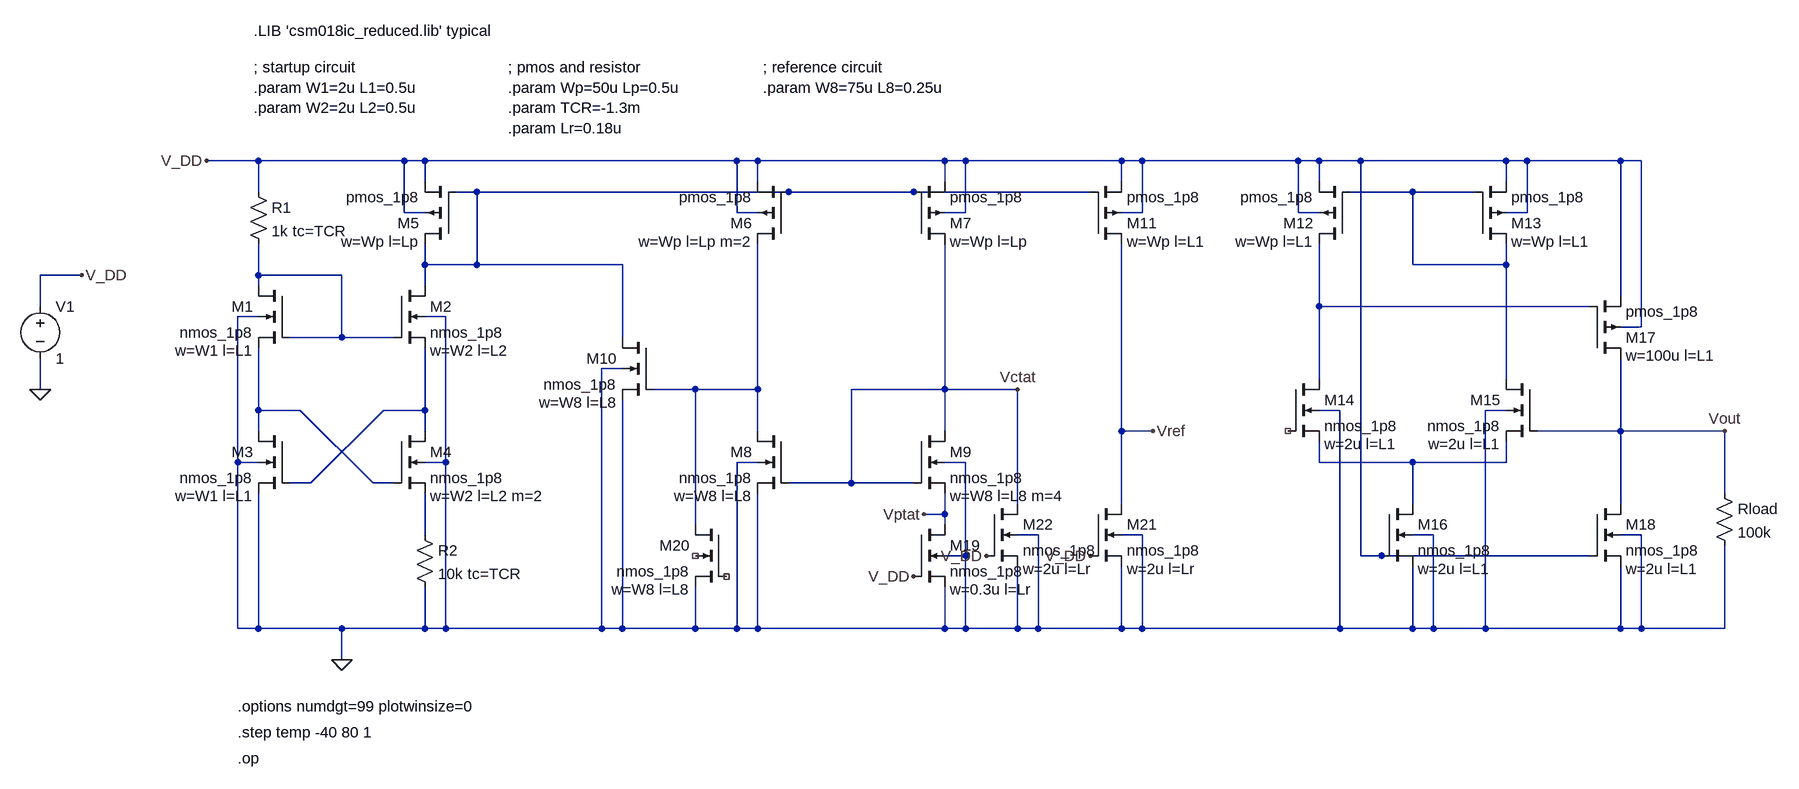
[diagram p0: schematic ldo_mos.asc]
ldo_mos.asc, the LTspice schematic file:
Version 4
SHEET 1 2504 792
WIRE 144 -144 64 -144
WIRE 368 -144 144 -144
WIRE 400 -144 368 -144
WIRE 880 -144 400 -144
WIRE 912 -144 880 -144
WIRE 1200 -144 912 -144
WIRE 1232 -144 1200 -144
WIRE 1472 -144 1232 -144
WIRE 1504 -144 1472 -144
WIRE 1744 -144 1504 -144
WIRE 1776 -144 1744 -144
WIRE 1840 -144 1776 -144
WIRE 2064 -144 1840 -144
WIRE 2096 -144 2064 -144
WIRE 2240 -144 2096 -144
WIRE 2272 -144 2240 -144
WIRE 400 -112 400 -144
WIRE 912 -112 912 -144
WIRE 1200 -112 1200 -144
WIRE 1472 -112 1472 -144
WIRE 1776 -112 1776 -144
WIRE 2064 -112 2064 -144
WIRE 144 -96 144 -144
WIRE 480 -96 448 -96
WIRE 960 -96 480 -96
WIRE 1152 -96 960 -96
WIRE 1424 -96 1152 -96
WIRE 1920 -96 1824 -96
WIRE 2016 -96 1920 -96
WIRE 368 -64 368 -144
WIRE 400 -64 368 -64
WIRE 880 -64 880 -144
WIRE 912 -64 880 -64
WIRE 1232 -64 1232 -144
WIRE 1232 -64 1200 -64
WIRE 1504 -64 1504 -144
WIRE 1504 -64 1472 -64
WIRE 1744 -64 1744 -144
WIRE 1776 -64 1744 -64
WIRE 2096 -64 2096 -144
WIRE 2096 -64 2064 -64
WIRE 400 16 400 -16
WIRE 480 16 480 -96
WIRE 480 16 400 16
WIRE 704 16 480 16
WIRE 1920 16 1920 -96
WIRE 2064 16 2064 -16
WIRE 2064 16 1920 16
WIRE -128 32 -192 32
WIRE 144 32 144 -16
WIRE 272 32 144 32
WIRE 144 48 144 32
WIRE 400 48 400 16
WIRE 2240 64 2240 -144
WIRE -192 80 -192 32
WIRE 1776 80 1776 -16
WIRE 2192 80 1776 80
WIRE 144 96 112 96
WIRE 432 96 400 96
WIRE 2272 112 2272 -144
WIRE 2272 112 2240 112
WIRE 272 128 272 32
WIRE 272 128 192 128
WIRE 352 128 272 128
WIRE 704 128 704 16
WIRE 704 176 672 176
WIRE 1776 192 1776 80
WIRE 2064 192 2064 16
WIRE -192 208 -192 160
WIRE 816 208 752 208
WIRE 912 208 912 -16
WIRE 912 208 816 208
WIRE 1200 208 1200 -16
WIRE 1200 208 1056 208
WIRE 1312 208 1200 208
WIRE 144 240 144 144
WIRE 208 240 144 240
WIRE 400 240 400 144
WIRE 400 240 336 240
WIRE 1808 240 1776 240
WIRE 2064 240 2032 240
WIRE 144 272 144 240
WIRE 400 272 400 240
WIRE 912 272 912 208
WIRE 1200 272 1200 208
WIRE 1472 272 1472 -16
WIRE 1520 272 1472 272
WIRE 2240 272 2240 160
WIRE 2240 272 2112 272
WIRE 2400 272 2240 272
WIRE 112 320 112 96
WIRE 144 320 112 320
WIRE 432 320 432 96
WIRE 432 320 400 320
WIRE 912 320 880 320
WIRE 1232 320 1200 320
WIRE 1776 320 1776 288
WIRE 1920 320 1776 320
WIRE 2064 320 2064 288
WIRE 2064 320 1920 320
WIRE 224 352 336 240
WIRE 224 352 192 352
WIRE 320 352 208 240
WIRE 352 352 320 352
WIRE 1056 352 1056 208
WIRE 1056 352 960 352
WIRE 1152 352 1056 352
WIRE 2400 368 2400 272
WIRE 1312 384 1312 208
WIRE 1472 384 1472 272
WIRE 1920 384 1920 320
WIRE 2240 384 2240 272
WIRE 1200 400 1200 368
WIRE 1200 400 1168 400
WIRE 816 416 816 208
WIRE 1200 416 1200 400
WIRE 400 432 400 368
WIRE 1344 432 1312 432
WIRE 1504 432 1472 432
WIRE 1952 432 1920 432
WIRE 2272 432 2240 432
WIRE 1232 464 1232 320
WIRE 1232 464 1200 464
WIRE 1840 464 1840 -144
WIRE 1872 464 1840 464
WIRE 2192 464 1872 464
WIRE 112 576 112 320
WIRE 144 576 144 368
WIRE 144 576 112 576
WIRE 272 576 144 576
WIRE 400 576 400 512
WIRE 400 576 272 576
WIRE 432 576 432 320
WIRE 432 576 400 576
WIRE 672 576 672 176
WIRE 672 576 432 576
WIRE 704 576 704 224
WIRE 704 576 672 576
WIRE 816 576 816 512
WIRE 816 576 704 576
WIRE 880 576 880 320
WIRE 880 576 816 576
WIRE 912 576 912 368
WIRE 912 576 880 576
WIRE 1200 576 1200 512
WIRE 1200 576 912 576
WIRE 1232 576 1232 464
WIRE 1232 576 1200 576
WIRE 1312 576 1312 480
WIRE 1312 576 1232 576
WIRE 1344 576 1344 432
WIRE 1344 576 1312 576
WIRE 1472 576 1472 480
WIRE 1472 576 1344 576
WIRE 1504 576 1504 432
WIRE 1504 576 1472 576
WIRE 1808 576 1808 240
WIRE 1808 576 1504 576
WIRE 1920 576 1920 480
WIRE 1920 576 1808 576
WIRE 1952 576 1952 432
WIRE 1952 576 1920 576
WIRE 2032 576 2032 240
WIRE 2032 576 1952 576
WIRE 2240 576 2240 480
WIRE 2240 576 2032 576
WIRE 2272 576 2272 432
WIRE 2272 576 2240 576
WIRE 2400 576 2400 448
WIRE 2400 576 2272 576
WIRE 272 624 272 576
FLAG 64 -144 V_DD
FLAG -192 208 0
FLAG -128 32 V_DD
FLAG 272 624 0
FLAG 1168 400 Vptat
FLAG 1312 208 Vctat
FLAG 1520 272 Vref
FLAG 2400 272 Vout
FLAG 1152 496 V_DD
FLAG 1424 464 V_DD
FLAG 1264 464 V_DD
SYMBOL nmos4 192 48 M0
WINDOW 123 56 100 Left 2
SYMATTR Value2 w=W1 l=L1
SYMATTR InstName M1
SYMATTR Value nmos_1p8
SYMBOL nmos4 192 272 M0
WINDOW 123 56 100 Left 2
SYMATTR Value2 w=W1 l=L1
SYMATTR InstName M3
SYMATTR Value nmos_1p8
SYMBOL nmos4 352 48 R0
WINDOW 123 56 100 Left 2
SYMATTR Value2 w=W2 l=L2
SYMATTR InstName M2
SYMATTR Value nmos_1p8
SYMBOL nmos4 352 272 R0
WINDOW 123 56 100 Left 2
SYMATTR Value2 w=W2 l=L2 m=2
SYMATTR InstName M4
SYMATTR Value nmos_1p8
SYMBOL res 128 -112 R0
SYMATTR InstName R1
SYMATTR Value 1k tc=TCR
SYMBOL res 384 416 R0
SYMATTR InstName R2
SYMATTR Value 10k tc=TCR
SYMBOL voltage -192 64 R0
WINDOW 123 0 0 Left 0
WINDOW 39 0 0 Left 0
SYMATTR InstName V1
SYMATTR Value 1
SYMBOL pmos4 960 -16 R180
WINDOW 123 56 4 Left 2
SYMATTR Value2 w=Wp l=Lp m=2
SYMATTR InstName M6
SYMATTR Value pmos_1p8
SYMBOL pmos4 1152 -16 M180
WINDOW 123 56 4 Left 2
SYMATTR Value2 w=Wp l=Lp
SYMATTR InstName M7
SYMATTR Value pmos_1p8
SYMBOL nmos4 960 272 M0
WINDOW 123 56 100 Left 2
SYMATTR Value2 w=W8 l=L8
SYMATTR InstName M8
SYMATTR Value nmos_1p8
SYMBOL nmos4 1152 272 R0
WINDOW 123 56 100 Left 2
SYMATTR Value2 w=W8 l=L8 m=4
SYMATTR InstName M9
SYMATTR Value nmos_1p8
SYMBOL nmos4 752 128 M0
WINDOW 123 56 100 Left 2
SYMATTR Value2 w=W8 l=L8
SYMATTR InstName M10
SYMATTR Value nmos_1p8
SYMBOL pmos4 448 -16 R180
WINDOW 123 56 4 Left 2
SYMATTR Value2 w=Wp l=Lp
SYMATTR InstName M5
SYMATTR Value pmos_1p8
SYMBOL pmos4 1424 -16 M180
WINDOW 123 56 4 Left 2
SYMATTR Value2 w=Wp l=L1
SYMATTR InstName M11
SYMATTR Value pmos_1p8
SYMBOL pmos4 1824 -16 R180
WINDOW 123 56 4 Left 2
SYMATTR Value2 w=Wp l=L1
SYMATTR InstName M12
SYMATTR Value pmos_1p8
SYMBOL pmos4 2016 -16 M180
WINDOW 123 56 4 Left 2
SYMATTR Value2 w=Wp l=L1
SYMATTR InstName M13
SYMATTR Value pmos_1p8
SYMBOL nmos4 1728 192 R0
WINDOW 123 56 100 Left 2
SYMATTR Value2 w=2u l=L1
SYMATTR InstName M14
SYMATTR Value nmos_1p8
SYMBOL nmos4 2112 192 M0
WINDOW 123 56 100 Left 2
SYMATTR Value2 w=2u l=L1
SYMATTR InstName M15
SYMATTR Value nmos_1p8
SYMBOL nmos4 1872 384 R0
WINDOW 123 56 100 Left 2
SYMATTR Value2 w=2u l=L1
SYMATTR InstName M16
SYMATTR Value nmos_1p8
SYMBOL res 2384 352 R0
SYMATTR InstName Rload
SYMATTR Value 100k
SYMBOL nmos4 2192 384 R0
WINDOW 123 56 100 Left 2
SYMATTR Value2 w=2u l=L1
SYMATTR InstName M18
SYMATTR Value nmos_1p8
SYMBOL pmos4 2192 160 M180
WINDOW 123 56 4 Left 2
SYMATTR Value2 w=100u l=L1
SYMATTR InstName M17
SYMATTR Value pmos_1p8
SYMBOL nmos4 1152 416 R0
WINDOW 123 56 100 Left 2
SYMATTR Value2 w=0.3u l=Lr
SYMATTR InstName M19
SYMATTR Value nmos_1p8
SYMBOL nmos4 1424 384 R0
WINDOW 123 56 100 Left 2
SYMATTR Value2 w=2u l=Lr
SYMATTR InstName M21
SYMATTR Value nmos_1p8
SYMBOL nmos4 1264 384 R0
WINDOW 123 56 100 Left 2
SYMATTR Value2 w=2u l=Lr
SYMATTR InstName M22
SYMATTR Value nmos_1p8
SYMBOL nmos4 864 416 M0
WINDOW 123 56 100 Left 2
SYMATTR Value2 w=W8 l=L8
SYMATTR InstName M20
SYMATTR Value nmos_1p8
TEXT 136 -344 Left 2 !.LIB 'csm018ic_reduced.lib' typical
TEXT 112 696 Left 2 !.options numdgt=99 plotwinsize=0
TEXT 136 -288 Left 2 !; startup circuit\n.param W1=2u L1=0.5u\n.param W2=2u L2=0.5u
TEXT 112 776 Left 2 !.op
TEXT 112 736 Left 2 !.step temp -40 80 1
TEXT 920 -288 Left 2 !; reference circuit\n.param W8=75u L8=0.25u
TEXT 528 -288 Left 2 !; pmos and resistor\n.param Wp=50u Lp=0.5u\n.param TCR=-1.3m\n.param Lr=0.18u

The netlist it stands for:
* ldo_mos.asc
M1 N003 N003 N006 0 nmos_1p8 w=W1 l=L1
M3 N006 N007 0 0 nmos_1p8 w=W1 l=L1
M2 N001 N003 N007 0 nmos_1p8 w=W2 l=L2
M4 N007 N006 N009 0 nmos_1p8 w=W2 l=L2 m=2
R1 V_DD N003 1k tc=TCR
R2 N009 0 10k tc=TCR
V1 V_DD 0 1
M6 N005 N001 V_DD V_DD pmos_1p8 w=Wp l=Lp m=2
M7 Vctat N001 V_DD V_DD pmos_1p8 w=Wp l=Lp
M8 N005 Vctat 0 0 nmos_1p8 w=W8 l=L8
M9 Vctat Vctat Vptat 0 nmos_1p8 w=W8 l=L8 m=4
M10 N001 N005 0 0 nmos_1p8 w=W8 l=L8
M5 N001 N001 V_DD V_DD pmos_1p8 w=Wp l=Lp
M11 Vref N001 V_DD V_DD pmos_1p8 w=Wp l=L1
M12 N004 N002 V_DD V_DD pmos_1p8 w=Wp l=L1
M13 N002 N002 V_DD V_DD pmos_1p8 w=Wp l=L1
M14 N004 NC_01 N008 0 nmos_1p8 w=2u l=L1
M15 N002 Vout N008 0 nmos_1p8 w=2u l=L1
M16 N008 V_DD 0 0 nmos_1p8 w=2u l=L1
Rload Vout 0 100k
M18 Vout V_DD 0 0 nmos_1p8 w=2u l=L1
M17 Vout N004 V_DD V_DD pmos_1p8 w=100u l=L1
M19 Vptat V_DD 0 0 nmos_1p8 w=0.3u l=Lr
M21 Vref V_DD 0 0 nmos_1p8 w=2u l=Lr
M22 Vctat V_DD 0 0 nmos_1p8 w=2u l=Lr
M20 N005 NC_02 0 NC_03 nmos_1p8 w=W8 l=L8
.model NMOS NMOS
.model PMOS PMOS
.lib standard.mos
.LIB 'csm018ic_reduced.lib' typical
.options numdgt=99 plotwinsize=0
; startup circuit
.param W1=2u L1=0.5u
.param W2=2u L2=0.5u
.op
.step temp -40 80 1
; reference circuit
.param W8=75u L8=0.25u
; pmos and resistor
.param Wp=50u Lp=0.5u
.param TCR=-1.3m
.param Lr=0.18u
.backanno
.end